# Altium schematic sheet QCLogic Rev B Sht1 MCU IO.SchDoc
size A3
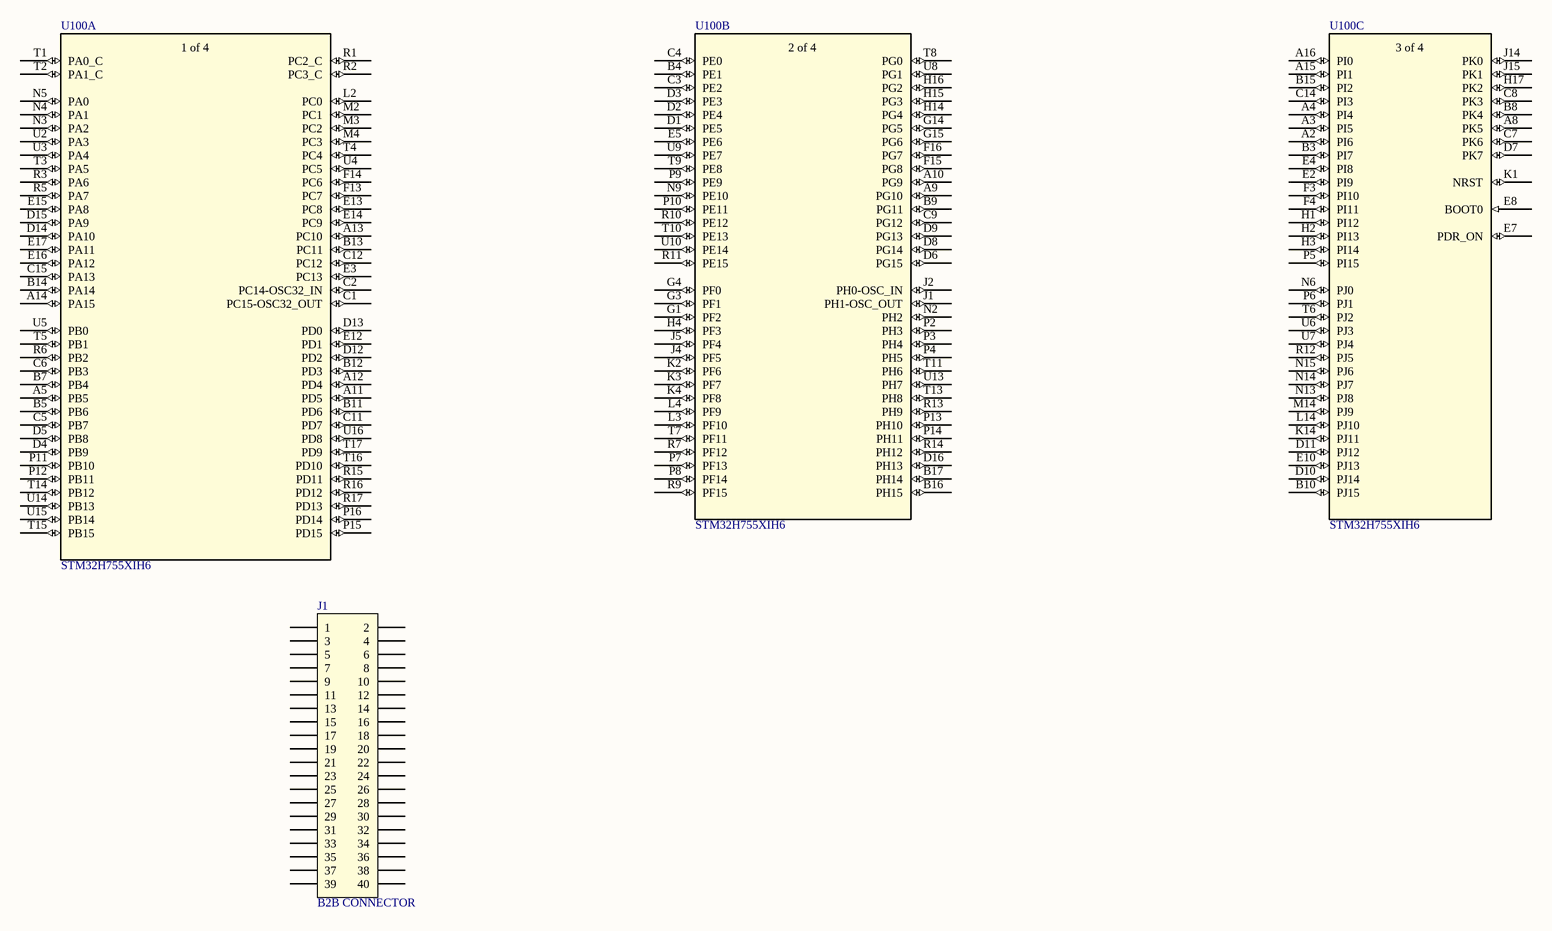
[diagram p0: QCLogic Rev B Sht1 MCU IO.SchDoc]

## Parts
J1  B2B CONNECTOR  [CONN B2B RECPT 40POS SMD GOLD]
U100  STM32H755XIH6  [TFBGA240+25]  (parts A,B,C of 4)

## Nets

Not connected (* = marked no-connect by the designer): J1 1 2 3 4 5 6 7 8 9 10 11 12 13 14 15 16 17 18 19 20 21 22 23 24 25 26 27 28 29 30 31 32 33 34 35 36 37 38 39 40; U100 A2(PI6) A3(PI5) A4(PI4) A5(PB5) A8(PK5) A9(PG10) A10(PG9) A11(PD5) A12(PD4) A13(PC10) A14(PA15) A15(PI1) A16(PI0) B3(PI7) B4(PE1) B5(PB6) B7(PB4) B8(PK4) B9(PG11) B10(PJ15) B11(PD6) B12(PD3) B13(PC11) B14(PA14) B15(PI2) B16(PH15) B17(PH14) C1(PC15-OSC32_OUT) C2(PC14-OSC32_IN) C3(PE2) C4(PE0) C5(PB7) C6(PB3) C7(PK6) C8(PK3) C9(PG12) C11(PD7) C12(PC12) C14(PI3) C15(PA13) D1(PE5) D2(PE4) D3(PE3) D4(PB9) D5(PB8) D6(PG15) D7(PK7) D8(PG14) D9(PG13) D10(PJ14) D11(PJ12) D12(PD2) D13(PD0) D14(PA10) D15(PA9) D16(PH13) E2(PI9) E3(PC13) E4(PI8) E5(PE6) E7(PDR_ON) E8(BOOT0) E10(PJ13) E12(PD1) E13(PC8) E14(PC9) E15(PA8) E16(PA12) E17(PA11) F3(PI10) F4(PI11) F13(PC7) F14(PC6) F15(PG8) F16(PG7) G1(PF2) G3(PF1) G4(PF0) G14(PG5) G15(PG6) H1(PI12) H2(PI13) H3(PI14) H4(PF3) H14(PG4) H15(PG3) H16(PG2) H17(PK2) J1(PH1-OSC_OUT) J2(PH0-OSC_IN) J4(PF5) J5(PF4) J14(PK0) J15(PK1) K1(NRST) K2(PF6) K3(PF7) K4(PF8) K14(PJ11) L2(PC0) L3(PF10) L4(PF9) L14(PJ10) M2(PC1) M3(PC2) M4(PC3) M14(PJ9) N2(PH2) N3(PA2) N4(PA1) N5(PA0) N6(PJ0) N9(PE10) N13(PJ8) N14(PJ7) N15(PJ6) P2(PH3) P3(PH4) P4(PH5) P5(PI15) P6(PJ1) P7(PF13) P8(PF14) P9(PE9) P10(PE11) P11(PB10) P12(PB11) P13(PH10) P14(PH11) P15(PD15) P16(PD14) R1(PC2_C) R2(PC3_C) R3(PA6) R5(PA7) R6(PB2) R7(PF12) R9(PF15) R10(PE12) R11(PE15) R12(PJ5) R13(PH9) R14(PH12) R15(PD11) R16(PD12) R17(PD13) T1(PA0_C) T2(PA1_C) T3(PA5) T4(PC4) T5(PB1) T6(PJ2) T7(PF11) T8(PG0) T9(PE8) T10(PE13) T11(PH6) T13(PH8) T14(PB12) T15(PB15) T16(PD10) T17(PD9) U2(PA3) U3(PA4) U4(PC5) U5(PB0) U6(PJ3) U7(PJ4) U8(PG1) U9(PE7) U10(PE14) U13(PH7) U14(PB13) U15(PB14) U16(PD8)

## Notes on the sheet
- (in symbol IC MCU 32BIT 2MB FLASH TFBGA, part A) 1 of 4
- (in symbol IC MCU 32BIT 2MB FLASH TFBGA, part B) 2 of 4
- (in symbol IC MCU 32BIT 2MB FLASH TFBGA, part C) 3 of 4

## Library data of the parts
J1 = CONN B2B RCPT 40POS SMD GOLD: 40 Position Connector Receptacle, Outer Shroud Contacts Surface Mount Gold; 1. Manufacturer: Amphenol ICC (FCI); 2. Manufacturer Part Number: 10144517-041802LF; 3. Date Modified: 20201130
U100 = IC MCU 32BIT 2MB FLASH TFBGA: 1. Manufacturer: STMicroelectronics; 2. Manufacturer Part Number: STM32H755XIH6; 3. Date Modified: 20201206; 4. Footprint: TFBGA240+25